# EAGLE design MicroMod-Ethernet-Function-Board-W5500 (EAGLE 9.6.2)
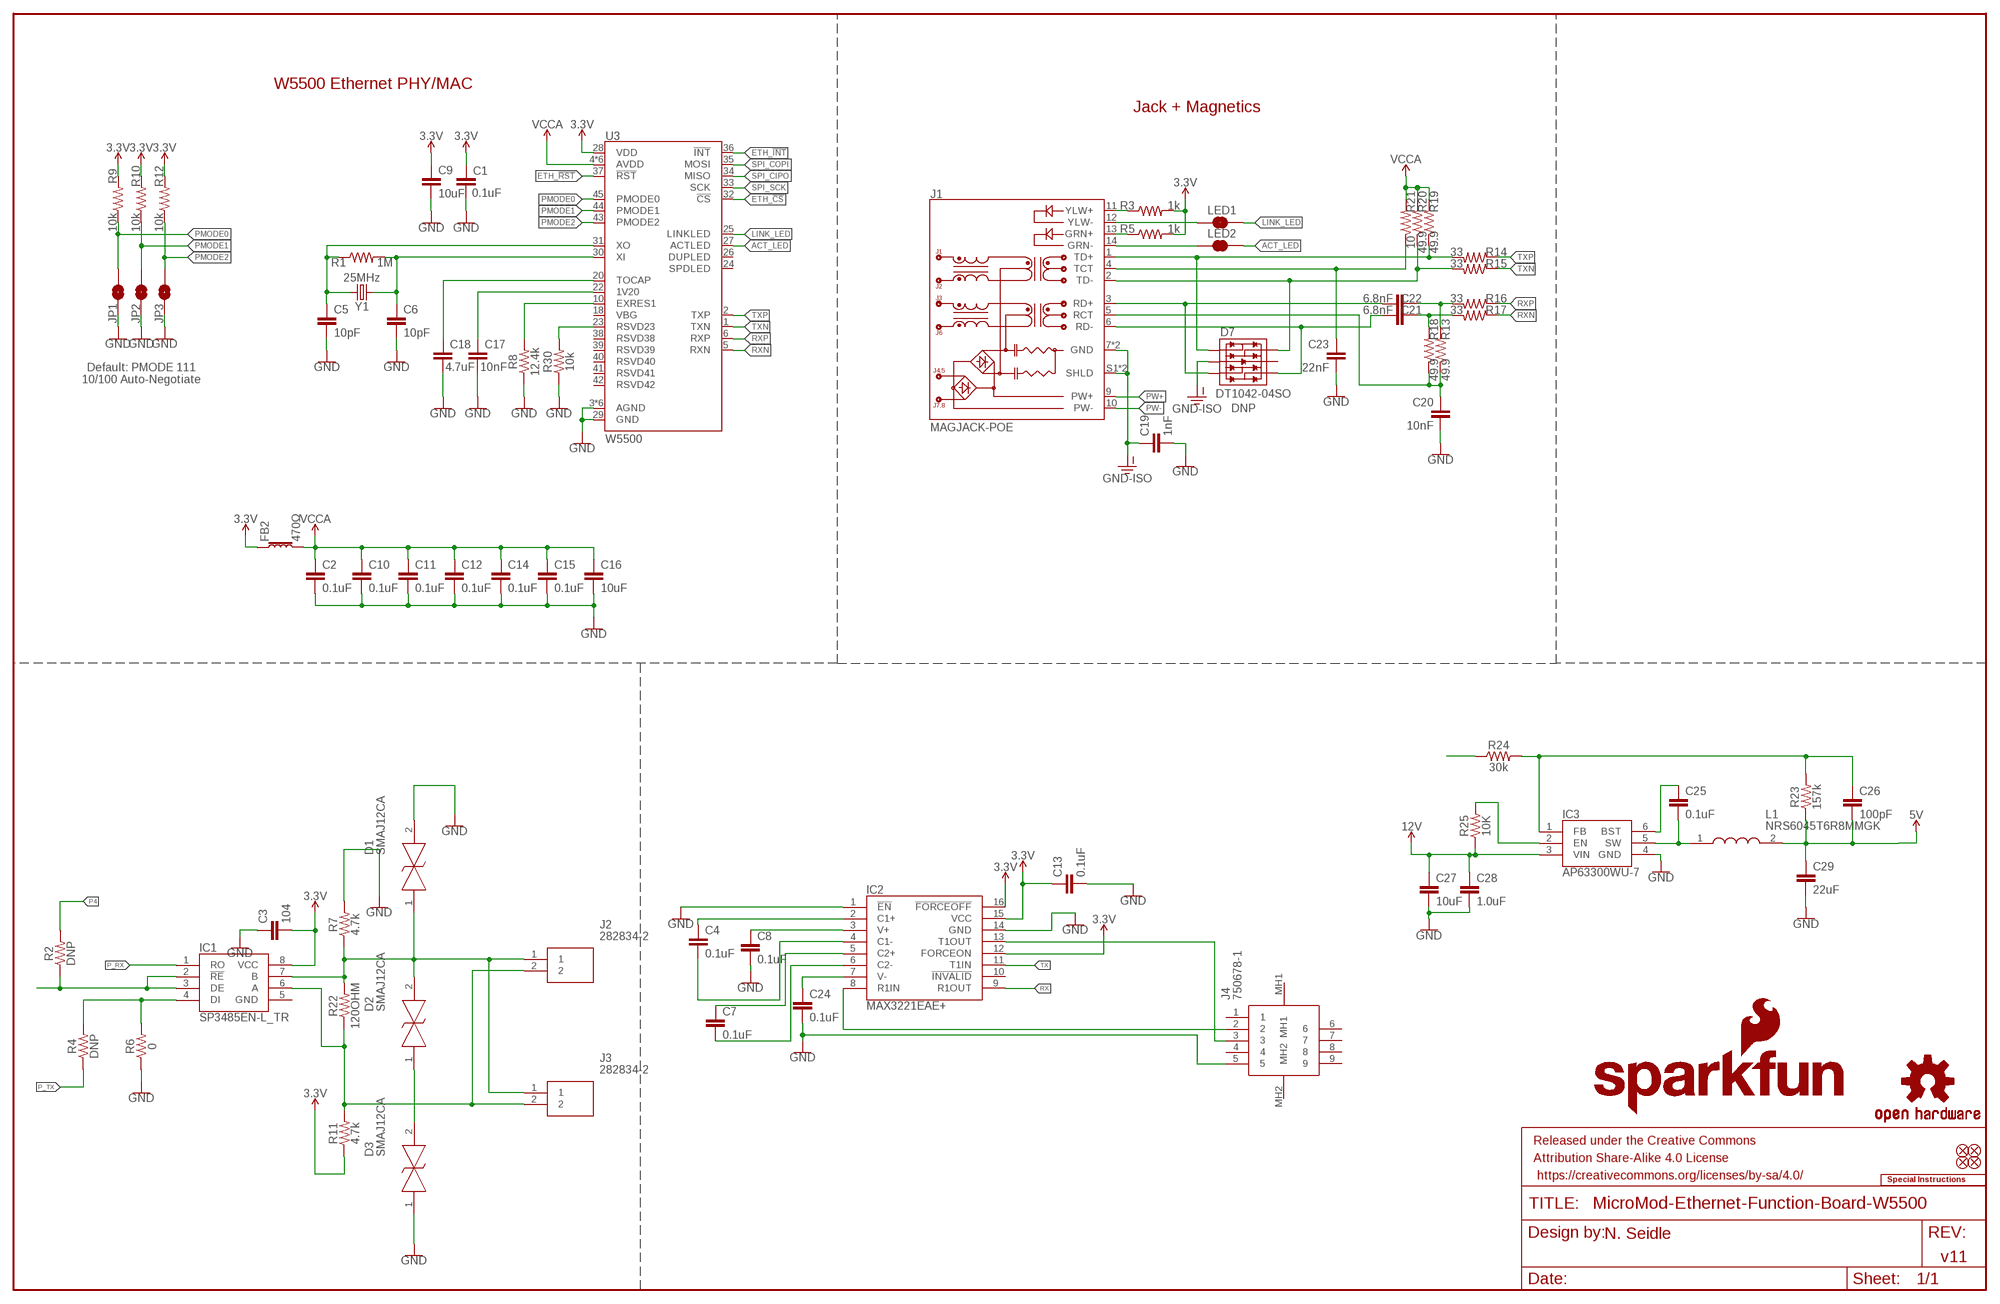
[diagram p0: schematic, sheet 1]

## Parts
C1  0.1uF  0.1UF-0603-25V-(+80/-20%)  [0603]
C2  0.1uF  0.1UF-0603-25V-5%  [0603]
C3  104  DNP-0402-TIGHT_NO_CREAM  [0402-TIGHT_NO_CREAM]
C4  0.1uF  0.1UF-0402T-10V-10%-X7R  [0402-TIGHT]
C5  10pF  10PF-0603-50V-5%  [0603]
C6  10pF  10PF-0603-50V-5%  [0603]
C7  0.1uF  0.1UF-0402T-10V-10%-X7R  [0402-TIGHT]
C8  0.1uF  0.1UF-0402T-10V-10%-X7R  [0402-TIGHT]
C9  10uF  10UF-0603-6.3V-20%  [0603]
C10  0.1uF  0.1UF-0603-25V-5%  [0603]
C11  0.1uF  0.1UF-0603-25V-5%  [0603]
C12  0.1uF  0.1UF-0603-25V-5%  [0603]
C13  0.1uF  0.1UF-0402T-10V-10%-X7R  [0402-TIGHT]
C14  0.1uF  0.1UF-0603-25V-5%  [0603]
C15  0.1uF  0.1UF-0603-25V-5%  [0603]
C16  10uF  10UF-0603-6.3V-20%  [0603]
C17  10nF  10NF-0603-50V-10%  [0603]
C18  4.7uF  4.7UF-0603-6.3V-(10%)  [0603]
C19  1nF  1.0NF/1000PF-1206-2KV-10%  [1206]
C20  10nF  10NF-0603-50V-10%  [0603]
C21  6.8nF  6.8NF/6800PF-0603-50V-5%  [0603]
C22  6.8nF  6.8NF/6800PF-0603-50V-5%  [0603]
C23  22nF  22NF/22,000PF-0603-50V-10%  [0603]
C24  0.1uF  0.1UF-0402T-10V-10%-X7R  [0402-TIGHT]
C25  0.1uF  0.1UF-0402T-10V-10%-X7R  [0402-TIGHT]
C26  100pF  100PF-0402T-50V-5%  [0402-TIGHT]
C27  10uF  10UF-0402T-6.3V-20%  [0402-TIGHT]
C28  1.0uF  1.0UF-0402T-16V-10%  [0402-TIGHT]
C29  22uF  22UF-0603-6.3V-20%  [0603]
D1  SMAJ12CA  [DIONM5026X229N]
D2  SMAJ12CA  [DIONM5026X229N]
D3  SMAJ12CA  [DIONM5026X229N]
D7  DT1042-04SO  TVS_DIODE_ARRAYSMD  [SOT-23-6]
FB2  470Ω  FERRITE_BEAD-0603-470Ω-100MHZ-1A-200MILIΩ  [0603]
FD1  FIDUCIALUFIDUCIAL  [FIDUCIAL-MICRO]
FD2  FIDUCIALUFIDUCIAL  [FIDUCIAL-MICRO]
FD3  FIDUCIALUFIDUCIAL  [FIDUCIAL-MICRO]
FD4  FIDUCIALUFIDUCIAL  [FIDUCIAL-MICRO]
FRAME1  FRAME-LEDGER  [CREATIVE_COMMONS]
IC1  SP3485EN-L_TR  [SOIC127P600X175-8N]
IC2  MAX3221EAE+  [SOP65P778X199-16N]
IC3  AP63300WU-7  [SOT95P280X90-6N]
J1  MAGJACK-POE  [MAGJACK-SYM_LED]
J2  282834-2  [282834-2_1]
J3  282834-2  [282834-2_1]
J4  750678-1  [7506781]
JP1  JUMPER-SMT_2_NO_SILK  [SMT-JUMPER_2_NO_SILK]
JP2  JUMPER-SMT_2_NO_SILK  [SMT-JUMPER_2_NO_SILK]
JP3  JUMPER-SMT_2_NO_SILK  [SMT-JUMPER_2_NO_SILK]
L1  NRS6045T6R8MMGK  [NRS6045T6R8MMGK]
LED1  JUMPER-SMT_2_NC_TRACE_SILK  [SMT-JUMPER_2_NC_TRACE_SILK]
LED2  JUMPER-SMT_2_NC_TRACE_SILK  [SMT-JUMPER_2_NC_TRACE_SILK]
LOGO1  SFE_LOGO_NAME_FLAME.1_INCH  [SFE_LOGO_NAME_FLAME_.1]
LOGO2  SPECIAL_INSTRUCTIONS-ORDERING  [ORDERING_INSTRUCTIONS]
LOGO3  OSHW-LOGOMINI  [OSHW-LOGO-MINI]
R1  1M  1MOHM-0603-1/4W-5%  [0603]
R2  DNP  DNP-0402T  [0402-TIGHT]
R3  1k  1KOHM-0603-1/10W-1%  [0603]
R4  DNP  DNP-0402T  [0402-TIGHT]
R5  1k  1KOHM-0603-1/10W-1%  [0603]
R6  0  0OHM-0402T-1/10W  [0402-TIGHT]
R7  4.7k  4.7KOHM-0402T-1/16W-1%  [0402-TIGHT]
R8  12.4k  12.4KOHM-0603-1/10W-1%  [0603]
R9  10k  10KOHM-0603-1/10W-1%  [0603]
R10  10k  10KOHM-0603-1/10W-1%  [0603]
R11  4.7k  4.7KOHM-0402T-1/16W-1%  [0402-TIGHT]
R12  10k  10KOHM-0603-1/10W-1%  [0603]
R13  49.9  49.9OHM-0603-1/10W-1%  [0603]
R14  33  33OHM-0603-1/10W-1%  [0603]
R15  33  33OHM-0603-1/10W-1%  [0603]
R16  33  33OHM-0603-1/10W-1%  [0603]
R17  33  33OHM-0603-1/10W-1%  [0603]
R18  49.9  49.9OHM-0603-1/10W-1%  [0603]
R19  49.9  49.9OHM-0603-1/10W-1%  [0603]
R20  49.9  49.9OHM-0603-1/10W-1%  [0603]
R21  10  10OHM-0603-1/10W-1%  [0603]
R22  120OHM  [0603]
R23  157k  DNP-0402T  [0402-TIGHT]
R24  30k  DNP-0402T  [0402-TIGHT]
R25  10K  10KOHM-0402-1/10W-0.1%  [0402-TIGHT]
R30  10k  10KOHM-0603-1/10W-1%  [0603]
U3  W5500  [LQFP-48]
Y1  25MHz  CRYSTAL-25MHZ-SMD-2.0X1.6MM  [CRYSTAL-SMD-2.0X1.6MM]

## Nets
3.3V: C1.1 C3.2 C9.1 C13.1 FB2.1 IC1.8(VCC) IC2.12(FORCEON) IC2.15(VCC) IC2.16(!FORCEOFF) R3.2 R5.2 R9.2 R10.2 R11.1 R12.2 U3.28(VDD)
5V: C26.2 C29.1 L1.2 R23.1
12V: C27.1 C28.1 IC3.3(VIN) R25.1
ACT_LED: LED2.2 U3.27(ACTLED)
ETH_!CS!: U3.32(!CS!)
ETH_!INT!: U3.36(!INT!)
ETH_!RST!: U3.37(!RST!)
GND: C1.2 C2.2 C3.1 C5.2 C6.2 C8.2 C9.2 C10.2 C11.2 C12.2 C13.2 C14.2 C15.2 C16.2 C17.2 C18.2 C19.2 C20.2 C23.2 C24.2 C27.2 C28.2 C29.2 D1.2 D3.1 IC2.1(!EN) IC2.14(GND) IC3.4(GND) J4.5 JP1.1 JP2.1 JP3.1 R6.1 R7.2 R8.1 R30.1 U3.3(AGND) U3.9(AGND) U3.14(AGND) U3.16(AGND) U3.19(AGND) U3.29(GND) U3.48(AGND)
GND-ISO: C19.1 D7.2(VSS) J1.7(GND) J1.8(GND) J1.S1(SHLD) J1.S2(SHLD)
LINK_LED: LED1.2 U3.25(LINKLED)
N$1: C5.1 R1.1 U3.31(XO) Y1.1
N$2: C6.1 R1.2 U3.30(XI) Y1.3
N$3: J1.14(GRN-) LED2.1
N$4: J1.12(YLW-) LED1.1
N$5: C7.1 IC2.5(C2+)
N$6: IC1.2(!RE) IC1.3(DE) R2.1
N$7: IC1.4(DI) R4.2 R6.2
N$8: J1.13(GRN+) R5.1
N$9: C7.2 IC2.6(C2-)
N$10: J1.11(YLW+) R3.1
N$11: IC1.6(A) J2.2 J3.2 R11.2 R22.1
N$12: C4.2 IC2.4(C1-)
N$13: R8.2 U3.10(EXRES1)
N$14: C4.1 IC2.2(C1+)
N$15: C17.1 U3.22(1V20)
N$16: C18.1 U3.20(TOCAP)
N$17: R30.2 U3.23(RSVD23)
N$18: C8.1 IC2.3(V+)
N$19: D1.1 D2.2 IC1.7(B) J2.1 J3.1 R7.1 R22.2
N$20: D2.1 D3.2
N$21: C24.1 IC2.7(V-)
N$22: C25.2 IC3.5(SW) L1.1
N$23: IC2.8(R1IN) J4.2
N$24: IC2.13(T1OUT) J4.3
N$25: C25.1 IC3.6(BST)
N$27: C26.1 IC3.1(FB) R23.2 R24.2
N$29: R24.1
N$30: IC3.2(EN) R25.2
P4: R2.2
P_RX: IC1.1(RO)
P_TX: R4.1
PMODE0: JP1.2 R9.1 U3.45(PMODE0)
PMODE1: JP2.2 R10.1 U3.44(PMODE1)
PMODE2: JP3.2 R12.1 U3.43(PMODE2)
PW+: J1.9(PW+)
PW-: J1.10(PW-)
RCT: C20.1 J1.5(RCT) R13.1 R18.1
RD+: C22.2 D7.3(IO2) J1.3(RD+)
RD-: C21.2 D7.4(IO3) J1.6(RD-)
RX: IC2.9(R1OUT)
RXN: R17.1 U3.5(RXN)
RXN1: C21.1 R17.2 R18.2
RXP: R16.1 U3.6(RXP)
RXP1: C22.1 R13.2 R16.2
SPI_CIPO: U3.34(MISO)
SPI_COPI: U3.35(MOSI)
SPI_SCK: U3.33(SCK)
TCT: C23.1 J1.4(TCT) R21.1
TD+: D7.1(IO1) J1.1(TD+) R14.2 R19.1
TD-: D7.6(IO4) J1.2(TD-) R15.2 R20.1
TX: IC2.11(T1IN)
TXN: R15.1 U3.1(TXN)
TXP: R14.1 U3.2(TXP)
VCCA: C2.1 C10.1 C11.1 C12.1 C14.1 C15.1 C16.1 FB2.2 R19.2 R20.2 R21.2 U3.4(AVDD) U3.8(AVDD) U3.11(AVDD) U3.15(AVDD) U3.17(AVDD) U3.21(AVDD)
Unconnected: D7.5(VCC) IC1.5(GND) IC2.10(!INVALID) J4.1 J4.4 J4.6 J4.7 J4.8 J4.9 J4.MH1 J4.MH2 U3.18(VBG) U3.24(SPDLED) U3.26(DUPLED) U3.38(RSVD38) U3.39(RSVD39) U3.40(RSVD40) U3.41(RSVD41) U3.42(RSVD42)

## Notes on the sheet
- W5500 Ethernet PHY/MAC
- Jack + Magnetics
- Default: PMODE 111
  10/100 Auto-Negotiate
- DNP
- N. Seidle
- v11

## Library data of the parts
C1 = SparkFun-Capacitors:0.1UF: 0.1µF ceramic capacitors A capacitor is a passive two-terminal electrical component used to store electrical energy temporarily in an electric field.; PROD_ID: CAP-00810
C2 C10-C12 C14 C15 = SparkFun-Capacitors:0.1UF: 0.1µF ceramic capacitors A capacitor is a passive two-terminal electrical component used to store electrical energy temporarily in an electric field.; PROD_ID: CAP-08604
C3 = SparkFun-Capacitors:DNP: Do-Not-Populate capacitor; VALUE: DNP
C4 C7 C8 C13 C24 C25 = SparkFun-Capacitors:0.1UF: 0.1µF ceramic capacitors A capacitor is a passive two-terminal electrical component used to store electrical energy temporarily in an electric field.; PROD_ID: CAP-15083
C5 C6 = SparkFun-Capacitors:10PF: 10pF ceramic capacitors A capacitor is a passive two-terminal electrical component used to store electrical energy temporarily in an electric field.; PROD_ID: CAP-11812
C9 C16 = SparkFun-Capacitors:10UF: 10.0µF ceramic capacitors A capacitor is a passive two-terminal electrical component used to store electrical energy temporarily in an electric field.; PROD_ID: CAP-11015
C17 C20 = SparkFun-Capacitors:10NF: 0.01uF/10nF/10,000pF ceramic capacitors A capacitor is a passive two-terminal electrical component used to store electrical energy temporarily in an electric field. CAP-09321; PROD_ID: CAP-00867
C18 = SparkFun-Capacitors:4.7UF: 4.7µF ceramic capacitors A capacitor is a passive two-terminal electrical component used to store electrical energy temporarily in an electric field.; PROD_ID: CAP-08280
C19 = SparkFun-Capacitors:1.0NF/1000PF: 1nF/1,000pF ceramic capacitors A capacitor is a passive two-terminal electrical component used to store electrical energy temporarily in an electric field.; PROD_ID: CAP-16238
C21 C22 = SparkFun-Capacitors:6.8NF/6800PF: 5.6nF/5600pF ceramic capacitors A capacitor is a passive two-terminal electrical component used to store electrical energy temporarily in an electric field.; PROD_ID: CAP-16239
C23 = SparkFun-Capacitors:22NF/22,000PF: 0.022uF/22nF/22,000pF ceramic capacitors A capacitor is a passive two-terminal electrical component used to store electrical energy temporarily in an electric field.; PROD_ID: CAP-07885
C26 = SparkFun-Capacitors:100PF: 100pF/0.1nF ceramic capacitors A capacitor is a passive two-terminal electrical component used to store electrical energy temporarily in an electric field.; PROD_ID: CAP-13458
C27 = SparkFun-Capacitors:10UF: 10.0µF ceramic capacitors A capacitor is a passive two-terminal electrical component used to store electrical energy temporarily in an electric field.; PROD_ID: CAP-14848
C28 = SparkFun-Capacitors:1.0UF: 1µF ceramic capacitors A capacitor is a passive two-terminal electrical component used to store electrical energy temporarily in an electric field.; PROD_ID: CAP-12417
C29 = SparkFun-Capacitors:22UF: 22µF ceramic capacitors A capacitor is a passive two-terminal electrical component used to store electrical energy temporarily in an electric field.; PROD_ID: CAP-14464
D1-D3 = SMAJ12CA:SMAJ12CA: Littelfuse SMAJ12CA Bi-Directional TVS Diode, 400W peak, 2-Pin DO-214AC Source: Datasheet <http://www.littelfuse.com/~/media/electronics/datasheets/tvs_diodes/littelfuse_tvs_diode_smaj_datasheet.pdf.pdf>; ARROW_PART_NUMBER: SMAJ12CA; ARROW_PRICE-STOCK: https://www.arrow.com/en/products/smaj12ca/littelfuse?region=nac; DESCRIPTION: Littelfuse SMAJ12CA Bi-Directional TVS Diode, 400W peak, 2-Pin DO-214AC; HEIGHT: 2.29mm; MANUFACTURER_NAME: LITTELFUSE; MANUFACTURER_PART_NUMBER: SMAJ12CA; MOUSER_PART_NUMBER: 576-SMAJ12CA; MOUSER_PRICE-STOCK: https://www.mouser.co.uk/ProductDetail/Littelfuse/SMAJ12CA?qs=zHiv0nsVGmrc7h%252BZC5eROg%3D%3D
D7 = SparkFun-DiscreteSemi:TVS_DIODE_ARRAY; PROD_ID: IC-13538; VALUE: ESD Diode
FB2 = SparkFun-Coils:FERRITE_BEAD: Ferrite Bead (blocks, cores, rings, chokes, etc.) Inductor with layers of ferrite used to suppress high frequencies. Often used to isolate high frequency noise. SparkFun Products: IOIO-OTG - V2.2 <https://www.sparkfun.com/products/13613> SparkFun SAMD21 Mini Breakout <https://www.sparkfun.com/products/13664> SparkFun 6 Degrees of Freedom Breakout - LSM6DS3 <https://www.sparkfun.com/products/13339> SparkFun SAMD21 Dev Breakout <https://www.sparkfun.com/products/13672>; PROD_ID: NDUC-12579
FD1-FD4 = SparkFun-Aesthetics:FIDUCIAL: Fiducial Alignment Points Point-of-reference for pick-and-place machines and other optical instruments.
FRAME1 = SparkFun-Aesthetics:FRAME-LEDGER: Schematic Frame - Ledger Standard 11x14 US Ledger frame
IC1 = SP3485EN-L_TR:SP3485EN-L_TR: RS-485 Interface IC 3.3V LoPwr Half-Dup RS485w/10Mbps Data Source: Datasheet <https://www.maxlinear.com/ds/sp3485.pdf>; ARROW_PART_NUMBER: SP3485EN-L/TR; ARROW_PRICE-STOCK: https://www.arrow.com/en/products/sp3485en-ltr/maxlinear-inc?region=asia; DESCRIPTION: RS-485 Interface IC 3.3V LoPwr Half-Dup RS485w/10Mbps Data; HEIGHT: 1.75mm; MANUFACTURER_NAME: MaxLinear, Inc.; MANUFACTURER_PART_NUMBER: SP3485EN-L/TR; MOUSER_PART_NUMBER: 701-SP3485EN-L/TR; MOUSER_PRICE-STOCK: https://www.mouser.co.uk/ProductDetail/MaxLinear/SP3485EN-L-TR?qs=3EMgrMjM0fbQ17liGrle%2Fg%3D%3D
IC2 = MAX3221EAE+:MAX3221EAE+: MAX3221EAE+, Line Transceiver 1 1 1 235 kbit/s, 3 5.5 V, 16-Pin SSOP Source: Datasheet <http://datasheets.maximintegrated.com/en/ds/MAX3221-MAX3243.pdf>; ARROW_PART_NUMBER: MAX3221EAE+; ARROW_PRICE-STOCK: https://www.arrow.com/en/products/max3221eae/maxim-integrated?region=nac; DESCRIPTION: MAX3221EAE+, Line Transceiver 1 1 1 235 kbit/s, 3 5.5 V, 16-Pin SSOP; HEIGHT: 1.99mm; MANUFACTURER_NAME: Maxim Integrated; MANUFACTURER_PART_NUMBER: MAX3221EAE+; MOUSER_PART_NUMBER: 700-MAX3221EAE; MOUSER_PRICE-STOCK: https://www.mouser.co.uk/ProductDetail/Maxim-Integrated/MAX3221EAE%2b?qs=1THa7WoU59EPTKLIY53fFA%3D%3D
IC3 = AP63300WU-7:AP63300WU-7: DCDC CONV HV BUCK TSOT26 Source: Datasheet <https://www.diodes.com/assets/Datasheets/AP63300-AP63301.pdf>; ARROW_PART_NUMBER: AP63300WU-7; ARROW_PRICE-STOCK: https://www.arrow.com/en/products/ap63300wu-7/diodes-incorporated?region=nac; DESCRIPTION: DCDC CONV HV BUCK TSOT26; HEIGHT: 0.9mm; MANUFACTURER_NAME: Diodes Inc.; MANUFACTURER_PART_NUMBER: AP63300WU-7; MOUSER_PART_NUMBER: 621-AP63300WU-7; MOUSER_PRICE-STOCK: https://www.mouser.co.uk/ProductDetail/Diodes-Incorporated/AP63300WU-7?qs=bZr6mbWTK5nNNXnHDcrFZg%3D%3D
J1 = SparkFun-Connectors:MAGJACK-POE: MAGJACK: RJ-45 with POE and LEDs This is a single port, RJ45 ethernet jacks with built in transformer (magnetics), PoE rectifier diodes, status LEDs, and shielding.; PROD_ID: CONN-16253
J2 J3 = 282834-2:282834-2: TE Connectivity, Buchanan 2.54mm Pitch, 2 Way PCB Terminal Strip Source: Datasheet <https://www.te.com/commerce/DocumentDelivery/DDEController?Action=srchrtrv&DocNm=1-1773458-1_EURO_STYLE_QRG&DocType=Data Sheet&DocLang=English&PartCntxt=282834-2&DocFormat=pdf>; ARROW_PART_NUMBER: 282834-2; ARROW_PRICE-STOCK: https://www.arrow.com/en/products/282834-2/te-connectivity?region=europe; DESCRIPTION: TE Connectivity, Buchanan 2.54mm Pitch, 2 Way PCB Terminal Strip; HEIGHT: mm; MANUFACTURER_NAME: TE Connectivity; MANUFACTURER_PART_NUMBER: 282834-2; MOUSER_PART_NUMBER: 571-282834-2; MOUSER_PRICE-STOCK: https://www.mouser.co.uk/ProductDetail/TE-Connectivity/282834-2?qs=A%252Bip%252BNCYi6N8cVKuk8xDog%3D%3D
J4 = 750678-1:750678-1: D-Sub Standard Connectors DB-9 VERT RCPT Source: Datasheet <https://www.te.com/commerce/DocumentDelivery/DDEController?Action=showdoc&DocId=Customer Drawing750678JpdfEnglishENG_CD_750678_J.pdf750678-1>; ARROW_PART_NUMBER: 750678-1; ARROW_PRICE-STOCK: https://www.arrow.com/en/products/750678-1/te-connectivity; DESCRIPTION: D-Sub Standard Connectors DB-9 VERT RCPT; HEIGHT: 14.71mm; MANUFACTURER_NAME: TE Connectivity; MANUFACTURER_PART_NUMBER: 750678-1; MOUSER_PART_NUMBER: 571-7506781; MOUSER_PRICE-STOCK: https://www.mouser.co.uk/ProductDetail/TE-Connectivity/750678-1?qs=d5w0Orft5ToNQPwAt933DQ%3D%3D
JP1-JP3 = SparkFun-Jumpers:JUMPER-SMT_2_NO: Normally open jumper This jumper has two pads in close proximity to each other. Apply solder to close the connection. Round pads are easier to solder for beginners, but are a lot larger. SparkFun Product that uses the round pads: SparkFun EL Sequencer <https://www.sparkfun.com/products/12781>
L1 = NRS6045T6R8MMGK:NRS6045T6R8MMGK: Fixed Inductors 6.8uH 20% Source: Datasheet <https://ds.yuden.co.jp/TYCOMPAS/ut/download?pn=NRH2412T4R7MNGH &fileType=CA>; DESCRIPTION: Fixed Inductors 6.8uH 20%; HEIGHT: 4.5mm; MANUFACTURER_NAME: TAIYO YUDEN; MANUFACTURER_PART_NUMBER: NRS6045T6R8MMGK; MOUSER_PART_NUMBER: 963-NRS6045T6R8MMGK; MOUSER_PRICE-STOCK: https://www.mouser.co.uk/ProductDetail/Taiyo-Yuden/NRS6045T6R8MMGK?qs=y6ZabgHbY%252Bx7IpZbumkeyA%3D%3D
LED1 LED2 = SparkFun-Jumpers:JUMPER-SMT_2_NC_TRACE: Normally closed trace jumper This jumper has a trace between two pads so it's normally closed (NC). Use a razor knife to open the connection. For best results follow the IPC guidelines for cutting traces: Cutout at least 0.063 mm (0.005 in). Remove all loose material to clean up the cut area. Seal the cut with an approved epoxy. Reapply solder to reclose the connection.
LOGO1 = SparkFun-Aesthetics:SFE_LOGO_NAME_FLAME: SparkFun Font Logo w/ Flame This is the SparkFun full logo. The logo on the schematic will always be the same size; the package variant is the height of the flame part of the logo. Default layer for the logo on the board is tSilk.
LOGO2 = SparkFun-Aesthetics:SPECIAL_INSTRUCTIONS: Special Ordering/Production Instructions Alert Symbol for special PCB ordering instructions or unique production process warnings. Ordering Instructions Production Instructions Types of information that should be added to box: Copper weight Soldermask color Silk color PCB thickness Number of layers PCB Standard: 1.6mm FR4 1 oz copper immersion silver plating red soldermask white silkscreen Types of information that should be added to box: Special wash requirements Depaneling instructions Humidification Glue curing Default text settings: 0.07 inch 9% ratio 50% line distance
LOGO3 = SparkFun-Aesthetics:OSHW-LOGO: Open-Source Hardware (OSHW) Logo This logo indicates the piece of hardware it is found on incorporates a OSHW license and/or adheres to the definition of open source hardware found here: http://freedomdefined.org/OSHW
R1 = SparkFun-Resistors:1MOHM: 1MΩ resistor A resistor is a passive two-terminal electrical component that implements electrical resistance as a circuit element. Resistors act to reduce current flow, and, at the same time, act to lower voltage levels within circuits. - Wikipedia; PROD_ID: RES-07868
R2 R4 = SparkFun-Resistors:DNP: Do-Not-Populate resistor A resistor is a passive two-terminal electrical component that implements electrical resistance as a circuit element. Resistors act to reduce current flow, and, at the same time, act to lower voltage levels within circuits. - Wikipedia
R3 R5 = SparkFun-Resistors:1KOHM: 1kΩ resistor A resistor is a passive two-terminal electrical component that implements electrical resistance as a circuit element. Resistors act to reduce current flow, and, at the same time, act to lower voltage levels within circuits. - Wikipedia; PROD_ID: RES-07856
R6 = SparkFun-Resistors:0OHM: 0Ω resistor A resistor is a passive two-terminal electrical component that implements electrical resistance as a circuit element. Resistors act to reduce current flow, and, at the same time, act to lower voltage levels within circuits. - Wikipedia; PROD_ID: RES-14244
R7 R11 = SparkFun-Resistors:4.7KOHM: 4.7kΩ resistor A resistor is a passive two-terminal electrical component that implements electrical resistance as a circuit element. Resistors act to reduce current flow, and, at the same time, act to lower voltage levels within circuits. - Wikipedia; PROD_ID: RES-15343
R8 = SparkFun-Resistors:12.4KOHM: 12.4kΩ resistor A resistor is a passive two-terminal electrical component that implements electrical resistance as a circuit element. Resistors act to reduce current flow, and, at the same time, act to lower voltage levels within circuits. - Wikipedia; PROD_ID: RES-16236
R9 R10 R12 R30 = SparkFun-Resistors:10KOHM: 10kΩ resistor A resistor is a passive two-terminal electrical component that implements electrical resistance as a circuit element. Resistors act to reduce current flow, and, at the same time, act to lower voltage levels within circuits. - Wikipedia; PROD_ID: RES-00824
R13 R18-R20 = SparkFun-Resistors:49.9OHM: 49.9Ω resistor A resistor is a passive two-terminal electrical component that implements electrical resistance as a circuit element. Resistors act to reduce current flow, and, at the same time, act to lower voltage levels within circuits. - Wikipedia; PROD_ID: RES-16237
R14-R17 = SparkFun-Resistors:33OHM: 33Ω resistor A resistor is a passive two-terminal electrical component that implements electrical resistance as a circuit element. Resistors act to reduce current flow, and, at the same time, act to lower voltage levels within circuits. - Wikipedia; PROD_ID: RES-08270
R21 = SparkFun-Resistors:10OHM: 10Ω resistor A resistor is a passive two-terminal electrical component that implements electrical resistance as a circuit element. Resistors act to reduce current flow, and, at the same time, act to lower voltage levels within circuits. - Wikipedia; PROD_ID: RES-12581
R22 = SparkFun-Resistors:120OHM: 120Ω resistor A resistor is a passive two-terminal electrical component that implements electrical resistance as a circuit element. Resistors act to reduce current flow, and, at the same time, act to lower voltage levels within circuits. - Wikipedia
R23 R24 = SparkFun-Resistors:DNP: Do-Not-Populate resistor A resistor is a passive two-terminal electrical component that implements electrical resistance as a circuit element. Resistors act to reduce current flow, and, at the same time, act to lower voltage levels within circuits. - Wikipedia; VALUE: DNP
R25 = SparkFun-Resistors:10KOHM: 10kΩ resistor A resistor is a passive two-terminal electrical component that implements electrical resistance as a circuit element. Resistors act to reduce current flow, and, at the same time, act to lower voltage levels within circuits. - Wikipedia; PROD_ID: RES-16147
U3 = SparkFun-IC-Comms:W5500; PROD_ID: IC-16240
Y1 = SparkFun-Clocks:CRYSTAL-25MHZ: 25MHz Crystal; PROD_ID: XTAL-16235

## Net classes
0 default: width 0 mm, drill 0 mm
1 vcc: width 0 mm

## Board
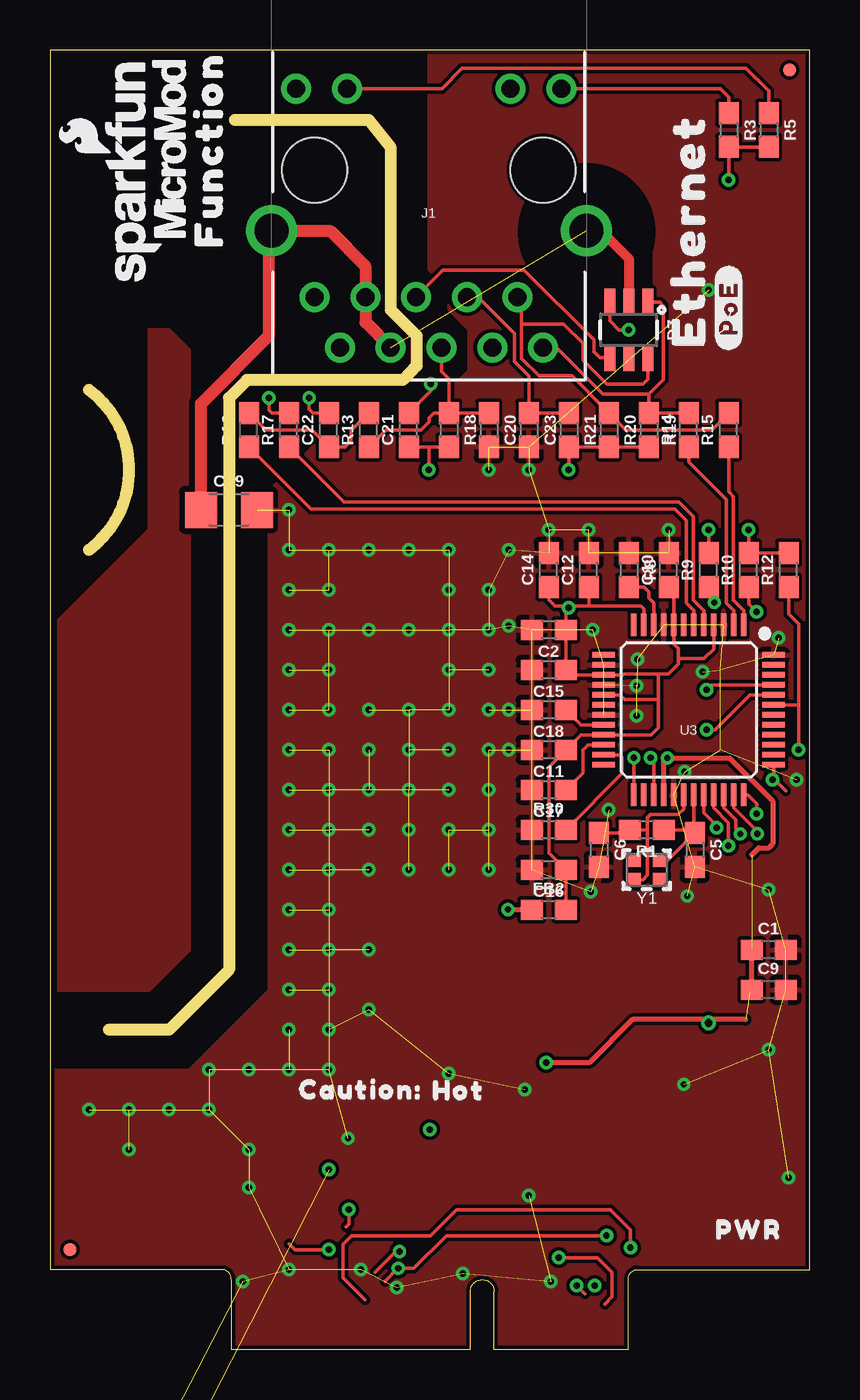
[diagram p1: board, top side]
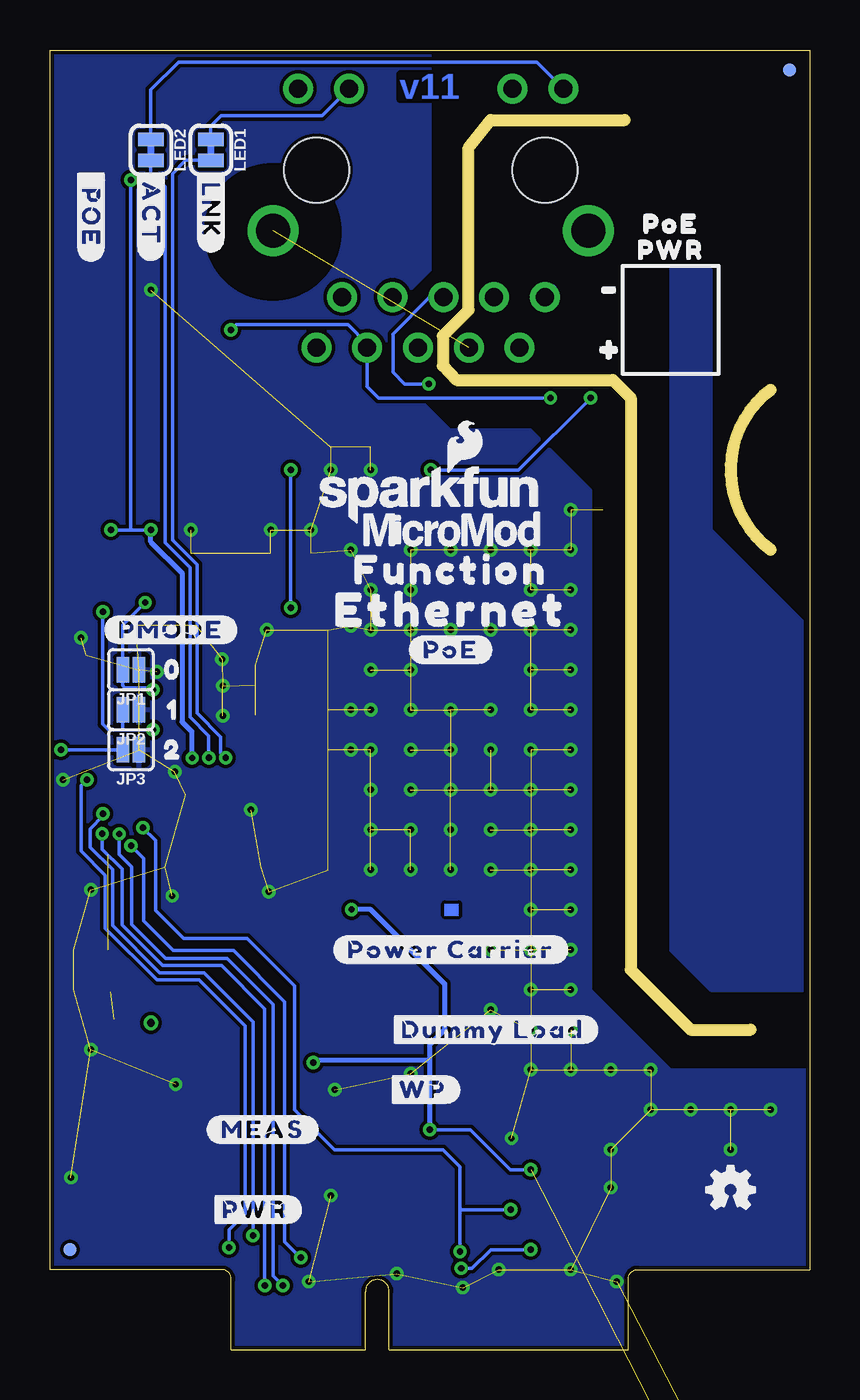
[diagram p2: board, bottom side, seen from below]

Size 38 x 65 mm. Coordinates in mm from the lower left corner, seen from the top.
Outline: 28.93,0 22.22,0 22.22,2.9 arc180 21.02,2.9 21.02,0 9.07,0 9.07,3.5 arc90 8.6,4 0,4 0,65 38,65 38,4 29.4,4 arc90 28.93,3.5 28.93,0
Copper layers (1*16): Top/Horz 0.035mm / dielectric 1.5mm / Bottom/Vert 0.035mm
Design rules "SparkFun-2-layer-TIGHT *": minimum track width 7mil, minimum drill 12mil, track to track 7mil, track to pad 7mil, pad to pad 7mil, via to via 7mil, smd to smd 7mil, copper to edge 7mil, drill to drill 7mil, minimum pad ring 7mil, minimum via ring 7mil, stop-mask expansion 4mil, vias tented up to drill 25mil, thermal gap 10mil
tRestrict: area 23.7,52.8 to 30,59; area 26.7,52.3 to 29.9,55.9
bRestrict: area 23.7,52.8 to 30,59
Milling: 12 lines

### Footprints (pad centres in the part's own frame; a part is rotated, then mirrored left to right if it is on the bottom)
0603 = smd 1.1 x 1: 1 -0.85,0; 2 0.85,0
0402-TIGHT_NO_CREAM = smd 0.6 x 0.6: 1 -0.5,0; 2 0.5,0
0402-TIGHT = smd 0.6 x 0.6: 1 -0.5,0; 2 0.5,0
1206 = smd 1.6 x 1.8: 1 -1.4,0; 2 1.4,0
DIONM5026X229N = smd 2.2 x 1.55: 1 -2.05,0; 2 2.05,0
SOT-23-6 = smd 0.55 x 1.35: 1 -0.95,-1.375; 2 0,-1.375; 3 0.95,-1.375; 4 0.95,1.375; 5 0,1.375; 6 -0.95,1.375
FIDUCIAL-MICRO = smd 0.635 x 0.635: 1 0,0
SOIC127P600X175-8N = smd 1.525 x 0.7: 1 -2.712,1.905; 2 -2.712,0.635; 3 -2.712,-0.635; 4 -2.712,-1.905; 5 2.712,-1.905; 6 2.712,-0.635; 7 2.712,0.635; 8 2.712,1.905
SOP65P778X199-16N = smd 1.705 x 0.45: 1 -3.498,2.275; 2 -3.498,1.625; 3 -3.498,0.975; 4 -3.498,0.325; 5 -3.498,-0.325; 6 -3.498,-0.975; 7 -3.498,-1.625; 8 -3.498,-2.275; 9 3.498,-2.275; 10 3.498,-1.625; 11 3.498,-0.975; 12 3.498,-0.325; 13 3.498,0.325; 14 3.498,0.975; 15 3.498,1.625; 16 3.498,2.275
SOT95P280X90-6N = smd 1.05 x 0.55: 1 -1.3,0.95; 2 -1.3,0; 3 -1.3,-0.95; 4 1.3,-0.95; 5 1.3,0; 6 1.3,0.95
MAGJACK-SYM_LED = drill 0.9 pad 1.5: 1 -5.715,8.89; 2 -4.445,6.35; 3 -3.175,8.89; 4 -1.905,6.35; 5 -0.635,8.89; 6 0.635,6.35; 7 1.905,8.89; 8 3.175,6.35; 9 4.445,8.89; 10 5.715,6.35; 11 -6.63,-4.06; 12 -4.09,-4.06; 13 4.09,-4.06; 14 6.63,-4.06 | drill 1.7 pad 2.4: S1 -7.875,3.05; S2 7.875,3.05 | hole 3.25: -5.715,0; 5.715,0
282834-2_1 = drill 1.2 pad 1.8 square: 1 0,0 | drill 1.2 pad 1.8: 2 2.54,0
7506781 = drill 1.04 pad 1.56: 1 0,0; 2 -2.74,0; 3 -5.48,0; 4 -8.22,0; 5 -10.96,0; 6 -1.37,-2.84; 7 -4.11,-2.84; 8 -6.85,-2.84; 9 -9.59,-2.84 | drill 3.05 pad 4.575: MH1 7.015,-1.42; MH2 -17.975,-1.42
SMT-JUMPER_2_NO_SILK = smd 0.635 x 1.27: 1 -0.406,0; 2 0.406,0
NRS6045T6R8MMGK = smd 1.6 x 5.7: 1 -2.35,0; 2 2.35,0
SMT-JUMPER_2_NC_TRACE_SILK = smd 0.66 x 1.27: 1 -0.521,0; 2 0.521,0
LQFP-48 = smd 0.254 x 1.143: 1 -2.75,-4.25; 2 -2.25,-4.25; 3 -1.75,-4.25; 4 -1.25,-4.25; 5 -0.75,-4.25; 6 -0.25,-4.25; 7 0.25,-4.25; 8 0.75,-4.25; 9 1.25,-4.25; 10 1.75,-4.25; 11 2.25,-4.25; 12 2.75,-4.25; 25 2.75,4.25; 26 2.25,4.25; 27 1.75,4.25; 28 1.25,4.25; 29 0.75,4.25; 30 0.25,4.25; 31 -0.25,4.25; 32 -0.75,4.25; 33 -1.25,4.25; 34 -1.75,4.25; 35 -2.25,4.25; 36 -2.75,4.25 | smd 1.143 x 0.254: 13 4.25,-2.75; 14 4.25,-2.25; 15 4.25,-1.75; 16 4.25,-1.25; 17 4.25,-0.75; 18 4.25,-0.25; 19 4.25,0.25; 20 4.25,0.75; 21 4.25,1.25; 22 4.25,1.75; 23 4.25,2.25; 24 4.25,2.75; 37 -4.25,2.75; 38 -4.25,2.25; 39 -4.25,1.75; 40 -4.25,1.25; 41 -4.25,0.75; 42 -4.25,0.25; 43 -4.25,-0.25; 44 -4.25,-0.75; 45 -4.25,-1.25; 46 -4.25,-1.75; 47 -4.25,-2.25; 48 -4.25,-2.75
CRYSTAL-SMD-2.0X1.6MM = smd 0.75 x 0.7: 1 -0.675,-0.5; 2 0.675,-0.5; 3 0.675,0.5; 4 -0.675,0.5

### Placement (x,y rotation side)
C1  35.95,20 0 top
C2  24.95,36 180 top
C3  -4.05,-27 0 top  (outside the outline)
C4  -8.05,-74 0 top  (outside the outline)
C5  32.25,25 270 top
C6  27.45,25 270 top
C7  -8.05,-77 0 top  (outside the outline)
C8  -8.05,-80 0 top  (outside the outline)
C9  35.95,18 0 top
C10  30.95,39 90 top
C11  24.95,30 180 top
C12  26.95,39 90 top
C13  -8.05,-83 0 top  (outside the outline)
C14  24.95,39 90 top
C15  24.95,34 180 top
C16  24.95,24 180 top
C17  24.95,28 180 top
C18  24.95,32 180 top
C19  8.95,42 0 top
C20  21.95,46 270 top
C21  17.95,46 90 top
C22  13.95,46 90 top
C23  23.95,46 270 top
C24  -8.05,-86 0 top  (outside the outline)
C25  -15.05,-117 0 top  (outside the outline)
C26  -15.05,-123 0 top  (outside the outline)
C27  -15.05,-132 0 top  (outside the outline)
C28  -15.05,-135 0 top  (outside the outline)
C29  -15.05,-139 0 top  (outside the outline)
D1  -2.05,-41 0 top  (outside the outline)
D2  -3.05,-45 0 top  (outside the outline)
D3  -4.05,-49 0 top  (outside the outline)
D7  28.95,51 180 top
FB2  24.95,22 0 top
FD1  1,5 90 top
FD2  37,64 90 top
FD3  37,5 270 bottom
FD4  1,64 270 bottom
FRAME1  35.51,-8.89 0 top  (outside the outline)
IC1  0.95,-13 0 top  (outside the outline)
IC2  -4.05,-69 0 top  (outside the outline)
IC3  -6.05,-105 0 top  (outside the outline)
J1  18.95,59 180 top
J2  -6.05,-55 0 top  (outside the outline)
J3  -6.05,-62 0 top  (outside the outline)
J4  11.95,-94 0 top  (outside the outline)
JP1  33.95,34 180 bottom
JP2  33.95,32 180 bottom
JP3  33.95,30 180 bottom
L1  -8.05,-111 0 top  (outside the outline)
LED1  29.95,60 270 bottom
LED2  32.95,60 270 bottom
LOGO1  4.14,58.97 90 top
LOGO2  45.67,60.96 0 top  (outside the outline)
LOGO3  3.95,8 0 bottom
LOGO4  SFE_LOGO_NAME_FLAME.1_INCH  [SFE_LOGO_NAME_FLAME_.1]  18.97,42.76 0 bottom
R1  29.85,26 180 top
R2  -4.05,-18 0 top  (outside the outline)
R3  33.95,61 270 top
R4  -4.05,-21 0 top  (outside the outline)
R5  35.95,61 270 top
R6  -4.05,-24 0 top  (outside the outline)
R7  -4.05,-30 0 top  (outside the outline)
R8  28.95,39 270 top
R9  32.95,39 90 top
R10  34.95,39 90 top
R11  -4.05,-33 0 top  (outside the outline)
R12  36.95,39 90 top
R13  15.95,46 90 top
R14  31.95,46 90 top
R15  33.95,46 90 top
R16  9.95,46 90 top
R17  11.95,46 90 top
R18  19.95,46 270 top
R19  29.95,46 270 top
R20  27.95,46 270 top
R21  25.95,46 270 top
R22  -4.05,-37 0 top  (outside the outline)
R23  -15.05,-120 0 top  (outside the outline)
R24  -15.05,-126 0 top  (outside the outline)
R25  -15.05,-129 0 top  (outside the outline)
R30  24.95,26 0 top
U3  31.95,32 180 top
U$1  [ETHERNET0]  17.95,37 0 bottom
U$2  [#POE#0]  17.95,35 0 bottom
U$3  [#POWER_CARRIER#0]  17.95,20 0 bottom
U$5  [#DUMMY_LOAD#0]  15.85,16 0 bottom
U$6  [#WP#0]  19.35,13 0 bottom
U$7  [PWR0]  34.95,6 0 top
U$8  [#ACT#0]  32.95,56.8 270 bottom
U$9  [POE0]  6.95,56.3 0 bottom
U$12  [#LNK#1]  29.95,57 270 bottom
U$13  [#PMODE#0]  31.95,36 0 bottom
U$14  [01]  31.85,34 0 bottom
U$15  [12]  31.85,32 0 bottom
U$16  [23]  31.85,30 0 bottom
U$17  [ETHERNET0]  31.95,56 90 top
U$18  [#POE#0]  33.95,52.1 90 top
U$19  [#0]  9.95,50 0 bottom
U$20  [CAUTION#0]  15.55,13 0 top
U$21  [HOT#1]  20.45,13.1 0 top
U$22  [#PWR#0]  27.75,7 0 bottom
U$23  [#_POE#0]  35.95,56.8 270 bottom
U$24  [PWR1]  6.95,55 0 bottom
U$25  [#1]  9.95,53 0 bottom
U$26  [FUNCTION0]  7.95,60 90 top
U$27  [FUNCTION0]  17.95,39 0 bottom
U$28  [#MEAS#3]  30.15,11 0 bottom
U$37  [MICROMOD_LOGO_.35]  17.95,41 0 bottom
U$63  [MICROMOD_LOGO_.35]  6,60 90 top
Y1  29.85,24 180 top

### Tracks (layer width: path | path; a pad name or v marks a point on that pad's centre or on a via)
3.3V  (via drill 0.3, 0.38)  (9 unrouted)
  Top/Horz 0.178: R5.2 R3.2 v33.95,58.5 | v34.95,41 R10.2 R12.2 | R9.2 v32.95,41 | v32.95,16.34 32.95,16.5
  Top/Horz 0.254: U3.28 30.7,29.4 v30.89,29.59 30.92,29.57 34.02,29.57 36.15,27.43 36.15,25.3 35.95,25.1 35.45,25.1 35.1,24.75 | FB2.1 23.11,22 v22.91,22 | 34.8,16.5 32.95,16.5 29.13,16.5 26.98,14.35 v24.83,14.35 | 35,17.9 C9.1 C1.1
  Bottom/Vert 0.178: v32.95,41 33.95,41 | 33.95,41 v34.95,41 | v33.95,58.5 33.95,41 | v13.95,9 14.95,9 16.95,11 v19,11
  Bottom/Vert 0.254: v30.89,29.59 30.89,30.89 31.39,31.39 31.39,38.84 32.95,40.4 v32.95,41 | 19,14.5 19,15.25 18.25,16 18.25,18.3 21.95,22 v22.91,22 | 19,14.5 v19,11 | v24.83,14.35 24.67,14.5 19,14.5 | v22.91,22
5V  (3 unrouted)
12V  (3 unrouted)
ACT_LED  (via drill 0.3)
  Top/Horz 0.178: U3.27 30.2,29.6 v30.05,29.6
  Bottom/Vert 0.178: v30.05,29.6 30.05,30.7 31,31.65 31,39.1 32.25,40.35 32.25,58.17 32.95,58.87 LED2.2
ETH_!CS!  (via drill 0.3)
  Top/Horz 0.178: v17.49,4.9 17.29,4.9 16.25,3.86 | U3.32 32.7,26.83 33.35,26.18 v33.35,26.1 | v14.95,7 14.95,6.3 14.8,6.15
  Bottom/Vert 0.178: v17.49,4.9 17.49,7 | 17.49,7 17.49,9.14 18.35,10 23.75,10 25.75,12 25.75,18.18 28.14,20.57 31.32,20.57 32.72,21.97 32.72,25.46 v33.35,26.1 | v14.95,7 17.49,7
ETH_!INT!  (via drill 0.3)
  Top/Horz 0.178: 16.75,3.42 17.39,4.06 v17.42,4.06 18.19,4.06 19.83,5.7 v27.85,5.7 | U3.36 34.9,27.75 35.35,27.3 v35.35,26.8 | 11.95,5.3 12.25,5 v13.95,5
  Bottom/Vert 0.178: v27.85,5.7 27.85,16.4 30.3,18.85 32.5,18.85 34.87,21.22 34.87,24 35.98,25.11 35.98,26.05 35.35,26.68 v35.35,26.8 | v13.95,5 15.94,5 16.89,4.06 v17.42,4.06
ETH_!RST!  (via drill 0.3)
  Top/Horz 0.178: v29.05,5.1 29.05,6 28.05,7 20.34,7 19.04,5.7 15.08,5.7 14.65,5.27 14.65,3.6 15.75,2.5 | U3.37 36.2,28.55 | 36.2,28.55 v36.15,28.5 | 36.8,27.95 36.2,28.55
  Bottom/Vert 0.178: v36.15,28.5 36.45,28.2 36.45,24.94 35.23,23.72 35.23,21.07 32.65,18.49 30.54,18.49 28.25,16.2 28.25,6.8 29.05,6 v29.05,5.1
GND  (via drill 0.3)  (148 unrouted)
  other vias: 3.95,10 17.35,3.1 20.65,3.8 36.95,8.6 35.95,15 35.95,23 27.05,22.9 31.75,28.9 29.35,31.7 29.35,33.2 29.4,34.53 27.15,36 36.45,35.6 32.65,33.9 30.95,41 26.95,41 24.95,41 22.95,36.2 22.95,32 22.95,30 21.95,28 21.95,26 11.95,42 21.95,44 14.92,10.56 23.95,7.7 15.55,4 9.65,3.4 9.95,10 15.95,17 13.95,22 23.75,13 23.95,44 27.95,27 31.71,13.26 11.95,4 13.95,24 13.95,26 13.95,28 13.95,30 13.95,32 13.95,34 13.95,36 13.95,38 13.95,40 13.95,20 13.95,18 13.95,16 13.95,14 11.95,14 11.95,16 11.95,18 11.95,20 11.95,22 11.95,24 11.95,26 11.95,28 11.95,30 11.95,32 11.95,34 11.95,36 11.95,38 11.95,40 15.95,24 15.95,26 15.95,28 15.95,30 15.95,32 15.95,36 15.95,40 15.95,20 17.95,24 17.95,26 17.95,28 17.95,30 17.95,32 17.95,36 17.95,40 19.95,24 19.95,26 19.95,28 19.95,30 19.95,32 19.95,34 19.95,36 19.95,38 19.95,40 19.95,13.8 31.89,22.68 21.95,30 21.95,32 21.95,34 21.95,36 21.95,38 22.95,40 21.95,24 9.95,14 7.95,12 7.95,14 5.95,12 3.95,12 1.95,12 9.95,8.1 32.95,53 37.35,28.5 25.05,3.4
  pour Top/Horz (isolate 0.152): -0.05,0 -0.05,14 6.95,14 10.95,18 10.95,43 13.95,46 17.95,46 20.95,49 20.95,51 19.95,52 19.95,53 18.95,54 18.95,65 37.95,65 37.95,0
  pour Bottom/Vert (isolate 0.152): -0.05,0 -0.05,14 6.95,14 10.95,18 10.95,43 13.95,46 17.95,46 20.95,49 20.95,51 19.95,52 19.95,53 18.95,54 18.95,65 37.95,65 37.95,0
GND-ISO  (1 unrouted)
  Top/Horz 0.508: J1.S1 27.57,55.95 28.95,54.57 D7.2
  Top/Horz 0.6: J1.7 15.77,51.38 J1.8 15.77,54.17 14,55.95 J1.S2 11.02,56 10.95,56 10.95,50.7 7.55,47.3 C19.1
LINK_LED  (via drill 0.3)
  Top/Horz 0.178: U3.25 29.2,29.59 v29.21,29.6
  Bottom/Vert 0.178: v29.21,29.6 29.45,29.84 29.45,30.65 30.64,31.84 30.64,39.25 31.87,40.48 31.87,58.82 31.21,59.48 LED1.2
N$1
  Top/Horz 0.178: U3.31 32.2,26 | 32.2,26 32.2,25.9 C5.1 30.9,24.5 Y1.1 | R1.1 32.2,26
N$2
  Top/Horz 0.178: U3.30 31.7,27.05 31.42,26.77 30.04,26.77 29.88,26.61 29.88,26 | C6.1 28.85,25.85 R1.2 29.88,26 | 29.88,26 29.88,23.73 29.65,23.5 Y1.3
N$3
  Bottom/Vert 0.178: LED2.1 32.95,63.01 31.57,64.39 13.65,64.39 J1.14
N$4
  Bottom/Vert 0.178: LED1.1 29.95,61.2 29.43,61.72 24.38,61.72 J1.12
N$5  (1 unrouted)
N$6  (2 unrouted)
N$7  (2 unrouted)
N$8
  Top/Horz 0.178: J1.13 19.6,63.06 20.62,64.08 34.82,64.08 35.95,62.95 R5.1
N$9  (1 unrouted)
N$10
  Top/Horz 0.178: J1.11 33.54,63.06 33.95,62.65 R3.1
N$11  (4 unrouted)
N$12  (1 unrouted)
N$13
  Top/Horz 0.178: U3.10 30.2,37.35 29.95,37.6 29.95,37.9 29.7,38.15 R8.2
N$14  (1 unrouted)
N$15
  Top/Horz 0.178: U3.22 26.9,30.25 26.65,30 26.65,28.85 C17.1
N$16
  Top/Horz 0.178: U3.20 26.55,31.25 C18.1
N$17
  Top/Horz 0.178: R30.2 28.61,28.82 28.61,29.64 28.5,29.75 U3.23
N$18  (1 unrouted)
N$19  (6 unrouted)
N$20  (1 unrouted)
N$21  (1 unrouted)
N$22  (2 unrouted)
N$23  (1 unrouted)
N$24  (1 unrouted)
N$25  (1 unrouted)
N$27  (3 unrouted)
N$30  (1 unrouted)
PMODE0  (via drill 0.3)
  Top/Horz 0.178: U3.45 33.1,33.25 v32.85,33 | R9.1 33.23,37.87 v33.23,37.36
  Bottom/Vert 0.178: v32.85,33 32.95,33.1 34.25,33.1 34.36,33.2 JP1.2 34.36,36.24 v33.23,37.36
PMODE1  (via drill 0.3)
  Top/Horz 0.178: R10.1 34.95,37.3 v35.35,36.9 | U3.44 35,32.75 33.25,31 v32.85,31
  Bottom/Vert 0.178: v32.85,31 34.35,31 | 34.35,31 35.05,31 35.35,31.3 v35.35,36.9 | JP2.2 34.36,31.01 34.35,31
PMODE2  (via drill 0.3)
  Top/Horz 0.178: R12.1 36.95,36.8 37.45,36.3 37.45,32.2 | v37.45,30 37.45,32.2 | U3.43 37.4,32.25 37.45,32.2
  Bottom/Vert 0.178: v37.45,30 JP3.2
PW1+
  pour Top/Horz (isolate 0.305): -0.05,18 4.95,18 6.95,20 6.95,50 5.95,51 4.95,51 4.95,41 -0.05,36
PW1-
  pour Bottom/Vert (isolate 0.305): 6.95,54 6.95,20 4.95,18 -0.05,18 -0.05,36 4.95,41 4.95,54
PW+
  Bottom/Vert 0.6: J1.9 14.39,50
PW-
  Bottom/Vert 0.6: 12.92,53 13.23,52.69 J1.10
RCT
  Top/Horz 0.178: R13.1 16.8,46 18.55,46 18.95,46.4 18.95,46.6 19.2,46.85 R18.1 | C20.1 R18.1 | R18.1 19.95,48.55 19.59,48.91 J1.5
RD+  (via drill 0.3)
  Top/Horz 0.178: C22.2 13.15,46.85 12.96,47.04 v12.96,47.6 | D7.3 28,51.45 28.45,51 v28.95,51
  Bottom/Vert 0.178: v12.96,47.6 21.55,47.6 22.12,48.17 J1.3 22.12,50.29 23.09,51.25 28.7,51.25 v28.95,51
RD-  (via drill 0.3)
  Top/Horz 0.178: C21.2 19.05,47.95 v19.05,48.3 | D7.4 27.5,49.62 27.2,49.92 27.2,50.52 23.72,54 19.66,54 J1.6
  Bottom/Vert 0.178: v19.05,48.3 20.25,48.3 20.85,48.9 20.85,50.8 19,52.65 J1.6
RXN
  Top/Horz 0.178: U3.5 32.7,36.97 32.18,37.49 32.18,41.67 31.45,42.4 14.7,42.4 R17.1
RXN1  (via drill 0.3)
  Top/Horz 0.178: C21.1 18.95,45.15 | 18.95,45.15 R18.2 | R17.2 11.1,46.85 10.95,47 v10.95,47.6 | v18.95,44 18.95,45.15
  Bottom/Vert 0.178: v10.95,47.6 14.55,44 v18.95,44
RXP
  Top/Horz 0.178: U3.6 32.2,36.97 31.83,37.34 31.83,41.47 31.25,42.04 13.06,42.04 R16.1
RXP1
  Top/Horz 0.178: R13.2 15.05,45.95 15.05,45.45 14.75,45.15 C22.1 13.1,46 10.8,46 R16.2
SPI_CIPO  (via drill 0.3)
  Top/Horz 0.178: 26.75,2.8 v26.35,3.2 | U3.34 33.7,27.1 34.3,26.5 34.3,26.03 v34.54,25.79
  Bottom/Vert 0.178: v26.35,3.2 26.85,3.7 26.85,17.27 29.14,19.56 32.21,19.56 33.91,21.26 33.91,24.14 34.54,24.77 v34.54,25.79
SPI_COPI  (via drill 0.3)
  Top/Horz 0.178: U3.35 34.2,27.1 35.38,25.92 v35.38,25.8
  Bottom/Vert 0.178: v27.25,3.2 27.25,17.04 29.42,19.2 32.36,19.2 34.39,21.24 34.39,24.03 35.38,25.02 v35.38,25.8
SPI_SCK  (via drill 0.3)
  Top/Horz 0.178: 27.75,2.26 28.12,2.63 28.12,3.87 27.39,4.6 v25.45,4.6 | U3.33 33.2,27.09 33.95,26.35 v33.95,25.2
  Bottom/Vert 0.178: v25.45,4.6 26.25,5.4 26.25,17.4 28.81,19.96 31.85,19.96 33.31,21.43 33.31,24.57 v33.95,25.2
TCT
  Top/Horz 0.178: R21.1 C23.1 23.95,48.7 23.24,49.41 23.24,50.81 21.4,52.65 J1.4
TD+
  Top/Horz 0.178: R19.1 30.15,46.85 | 30.15,46.85 R14.2 | 30.15,46.85 29.97,47.03 29.97,47.8 | J1.1 25.34,50.11 27.65,47.8 29.96,47.8 29.97,47.8 | D7.1 30.51,52.38 30.68,52.2 30.68,48.51 29.97,47.8
TD-
  Top/Horz 0.178: R15.2 33.1,46 28.8,46 R20.1 26.1,48.7 24.45,48.7 23.59,49.55 23.59,51.3 | J1.2 23.59,52.45 23.59,51.3 | 23.59,51.3 25.7,51.3 26.65,50.35 26.65,49.5 27.85,48.3 29.65,48.3 29.9,48.55 D7.6
TXN
  Top/Horz 0.178: U3.1 34.7,36.97 34.18,37.49 34.18,42.67 33.95,42.9 R15.1
TXP
  Top/Horz 0.178: U3.2 34.2,36.97 33.83,37.34 33.83,42.52 31.95,44.4 R14.1
VCCA  (via drill 0.3)
  Top/Horz 0.178: C10.1 31.2,37.9 U3.8 31.2,35.3 31.45,35.05 31.45,34.54 | U3.11 29.7,37.05 29.55,37.2 26.95,37.2 | U3.4 33.2,35.05 32.71,34.55 31.46,34.55 31.45,34.54 | R19.2 R20.2 R21.2 v25.95,44 | FB2.2 C16.1 24.95,24.85 24.95,29.15 C11.1 26.55,30.75 U3.21 30.06,30.75 30.43,31.11 30.43,32.51 | U3.17 28.52,32.75 28.76,32.51 30.43,32.51 | 31.45,34.54 31.45,34.29 30.94,33.78 30.43,33.78 | 30.43,33.78 30.43,32.51 | 30.43,33.78 29.81,33.78 29.8,33.8 28.7,33.8 28.66,33.75 U3.15 26.05,33.75 C15.1 C2.1 25.8,36.95 v25.95,37.1 25.95,37.2 | C14.1 24.95,37.5 25.25,37.2 25.95,37.2 | 26.95,37.2 25.95,37.2 | C12.1 26.95,37.2
  Bottom/Vert 0.178: v25.95,37.1 v25.95,44
(copper drawn outside any net)
  shapes: Bottom/Vert area x1

### Text on the board
Bottom/Vert: v11
Measures: Dimensions are in mm
tDocu: Board Thickness is 0.8mm | 2-Layer | Beveled Edge | ENIG Finish | N. Seidle